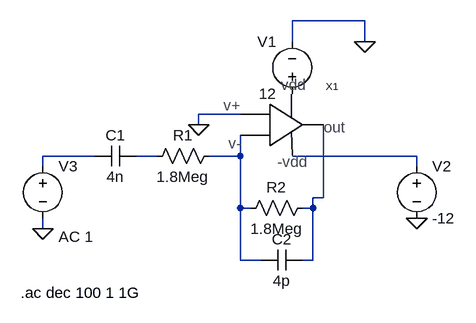
[diagram p0: schematic band_pass.asc]
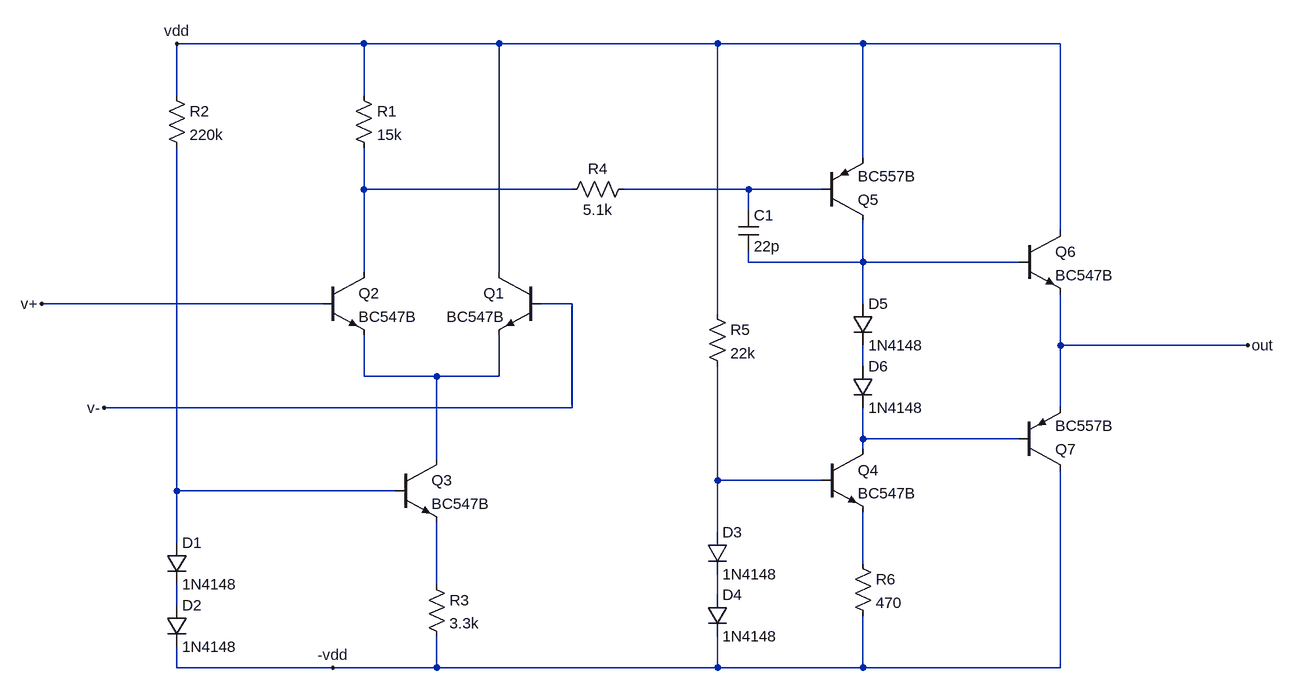
[diagram p1: sub-circuit op_basic.asc]
band_pass.asc, the LTspice schematic file:
Version 4
SHEET 1 880 680
WIRE 336 -16 224 -16
WIRE 224 16 224 -16
WIRE 336 16 336 -16
WIRE 144 128 80 128
WIRE 80 144 80 128
WIRE -80 192 -160 192
WIRE 16 192 -16 192
WIRE 144 192 144 160
WIRE 144 192 96 192
WIRE 416 192 224 192
WIRE -160 208 -160 192
WIRE 416 208 416 192
WIRE 272 256 272 144
WIRE 272 256 256 256
WIRE 144 272 144 192
WIRE 160 272 144 272
WIRE 256 272 256 256
WIRE 256 272 240 272
WIRE -160 304 -160 288
WIRE 144 352 144 272
WIRE 176 352 144 352
WIRE 256 352 256 272
WIRE 256 352 240 352
FLAG 80 144 0
FLAG 416 288 0
FLAG 336 16 0
FLAG -160 304 0
SYMBOL op_basic 272 128 R0
SYMATTR InstName X1
SYMBOL cap -16 176 R90
WINDOW 0 0 32 VBottom 2
WINDOW 3 32 32 VTop 2
SYMATTR InstName C1
SYMATTR Value 4n
SYMBOL res 112 176 R90
WINDOW 0 0 56 VBottom 2
WINDOW 3 32 56 VTop 2
SYMATTR InstName R1
SYMATTR Value 1.8Meg
SYMBOL res 256 256 R90
WINDOW 0 0 56 VBottom 2
WINDOW 3 32 56 VTop 2
SYMATTR InstName R2
SYMATTR Value 1.8Meg
SYMBOL cap 240 336 R90
WINDOW 0 0 32 VBottom 2
WINDOW 3 32 32 VTop 2
SYMATTR InstName C2
SYMATTR Value 4p
SYMBOL voltage 224 112 R180
WINDOW 0 24 96 Left 2
WINDOW 3 24 16 Left 2
WINDOW 123 0 0 Left 0
WINDOW 39 0 0 Left 0
SYMATTR InstName V1
SYMATTR Value 12
SYMBOL voltage 416 192 R0
WINDOW 123 0 0 Left 0
WINDOW 39 0 0 Left 0
SYMATTR InstName V2
SYMATTR Value -12
SYMBOL voltage -160 192 R0
WINDOW 123 24 124 Left 2
WINDOW 39 0 0 Left 0
SYMATTR InstName V3
SYMATTR Value ""
SYMATTR Value2 AC 1
TEXT -194 402 Left 2 !.ac dec 100 1 1G

op_basic.asc, the sub-circuit schematic file:
Version 4
SHEET 1 1488 1116
WIRE -496 -240 -784 -240
WIRE -288 -240 -496 -240
WIRE 48 -240 -288 -240
WIRE 272 -240 48 -240
WIRE 576 -240 272 -240
WIRE -784 -160 -784 -240
WIRE -496 -160 -496 -240
WIRE 272 -64 272 -240
WIRE -496 -16 -496 -80
WIRE -176 -16 -496 -16
WIRE 96 -16 -96 -16
WIRE 208 -16 96 -16
WIRE 96 16 96 -16
WIRE 576 48 576 -240
WIRE 96 96 96 80
WIRE 272 96 272 32
WIRE 272 96 96 96
WIRE 512 96 272 96
WIRE -496 112 -496 -16
WIRE -288 112 -288 -240
WIRE -560 160 -992 160
WIRE -176 160 -224 160
WIRE 272 160 272 96
WIRE 48 176 48 -240
WIRE 576 224 576 144
WIRE 864 224 576 224
WIRE 272 256 272 224
WIRE -496 272 -496 208
WIRE -384 272 -496 272
WIRE -288 272 -288 208
WIRE -288 272 -384 272
WIRE -176 320 -176 160
WIRE -176 320 -896 320
WIRE 576 320 576 224
WIRE 272 368 272 320
WIRE 512 368 272 368
WIRE 272 384 272 368
WIRE -384 400 -384 272
WIRE 48 432 48 256
WIRE 208 432 48 432
WIRE -784 448 -784 -80
WIRE -448 448 -784 448
WIRE 48 512 48 432
WIRE -784 528 -784 448
WIRE 272 560 272 480
WIRE -384 592 -384 496
WIRE 48 608 48 576
WIRE -784 624 -784 592
WIRE -784 720 -784 688
WIRE -544 720 -784 720
WIRE -384 720 -384 672
WIRE -384 720 -544 720
WIRE 48 720 48 672
WIRE 48 720 -384 720
WIRE 272 720 272 640
WIRE 272 720 48 720
WIRE 576 720 576 416
WIRE 576 720 272 720
FLAG 864 224 out
FLAG -784 -240 vdd
FLAG -544 720 -vdd
FLAG -992 160 v+
FLAG -896 320 v-
SYMBOL res -512 -176 R0
SYMATTR InstName R1
SYMATTR Value 15k
SYMBOL npn -224 112 M0
SYMATTR InstName Q1
SYMATTR Value BC547B
SYMBOL npn -560 112 R0
SYMATTR InstName Q2
SYMATTR Value BC547B
SYMBOL npn -448 400 R0
SYMATTR InstName Q3
SYMATTR Value BC547B
SYMBOL res -800 -176 R0
SYMATTR InstName R2
SYMATTR Value 220k
SYMBOL res -400 576 R0
SYMATTR InstName R3
SYMATTR Value 3.3k
SYMBOL diode -800 528 R0
SYMATTR InstName D1
SYMATTR Value 1N4148
SYMBOL diode -800 624 R0
SYMATTR InstName D2
SYMATTR Value 1N4148
SYMBOL res -80 -32 R90
WINDOW 0 0 56 VBottom 2
WINDOW 3 32 56 VTop 2
SYMATTR InstName R4
SYMATTR Value 5.1k
SYMBOL res 32 160 R0
SYMATTR InstName R5
SYMATTR Value 22k
SYMBOL diode 32 512 R0
SYMATTR InstName D3
SYMATTR Value 1N4148
SYMBOL diode 32 608 R0
SYMATTR InstName D4
SYMATTR Value 1N4148
SYMBOL res 256 544 R0
SYMATTR InstName R6
SYMATTR Value 470
SYMBOL npn 208 384 R0
SYMATTR InstName Q4
SYMATTR Value BC547B
SYMBOL diode 256 160 R0
SYMATTR InstName D5
SYMATTR Value 1N4148
SYMBOL diode 256 256 R0
SYMATTR InstName D6
SYMATTR Value 1N4148
SYMBOL pnp 208 32 M180
SYMATTR InstName Q5
SYMATTR Value BC557B
SYMBOL cap 80 16 R0
SYMATTR InstName C1
SYMATTR Value 22p
SYMBOL npn 512 48 R0
SYMATTR InstName Q6
SYMATTR Value BC547B
SYMBOL pnp 512 416 M180
SYMATTR InstName Q7
SYMATTR Value BC557B

The netlist it stands for:
* band_pass.asc
XX1 0 N003 P001 N004 N005 op_basic
C1 N002 N001 4n
R1 N003 N002 1.8Meg
R2 N005 N003 1.8Meg
C2 N005 N003 4p
V1 P001 0 12
V2 N004 0 -12
V3 N001 0 AC 1

* block symbol definitions
.subckt op_basic v+ v- vdd -vdd out
R1 vdd N001 15k
Q1 vdd v- N005 0 BC547B
Q2 N001 v+ N005 0 BC547B
Q3 N005 N008 N010 0 BC547B
R2 vdd N008 220k
R3 N010 -vdd 3.3k
D1 N008 N012 1N4148
D2 N012 -vdd 1N4148
R4 N002 N001 5.1k
R5 vdd N007 22k
D3 N007 N011 1N4148
D4 N011 -vdd 1N4148
R6 N009 -vdd 470
Q4 N006 N007 N009 0 BC547B
D5 N003 N004 1N4148
D6 N004 N006 1N4148
Q5 N003 N002 vdd 0 BC557B
C1 N002 N003 22p
Q6 vdd N003 out 0 BC547B
Q7 -vdd N006 out 0 BC557B
.ends op_basic

.model D D
.lib standard.dio
.model NPN NPN
.model PNP PNP
.lib standard.bjt
.ac dec 100 1 1G
.backanno
.end